# EAGLE design dip8_a3 (EAGLE 5.11)
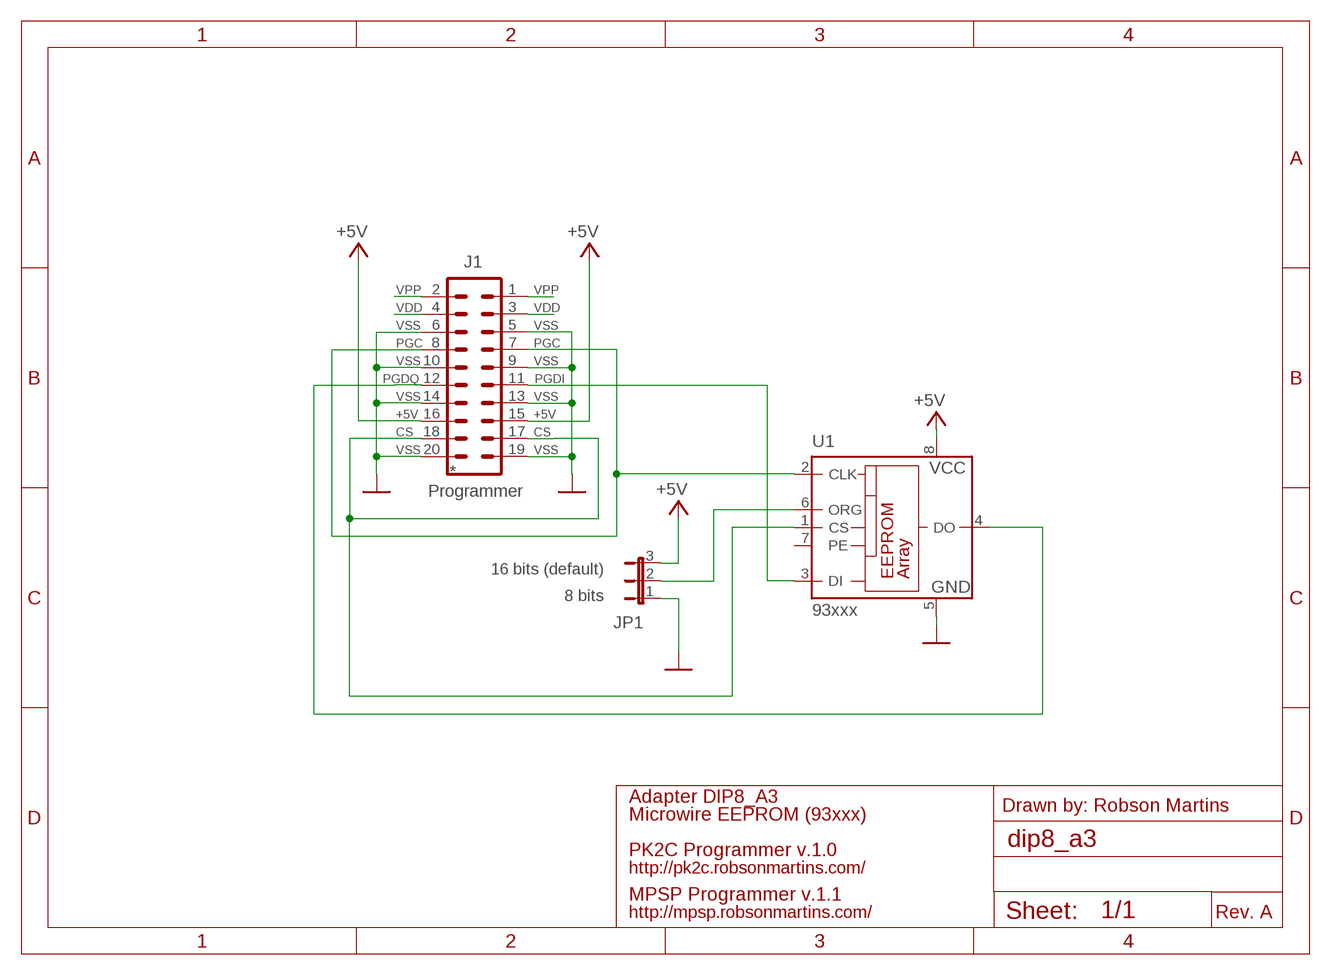
[diagram p0: schematic, sheet 1]

## Parts
J1  Programmer  MA10-2  [MA10-2]
JP1  JP2E  [JP2]
U1  93xxx  93C76CP  [DIL8]

## Nets
+5V: J1.15 J1.16 JP1.3 U1.8(VCC)
CS: J1.17 J1.18 U1.1(CS)
GND: J1.5 J1.6 J1.9 J1.10 J1.13 J1.14 J1.19 J1.20 JP1.1 U1.5(GND)
ORG_CHIP: JP1.2 U1.6(ORG)
PGC: J1.7 J1.8 U1.2(CLK)
PGDI: J1.11 U1.3(DI)
PGDQ: J1.12 U1.4(DO)
VDD: J1.3 J1.4
VPP: J1.1 J1.2
Unconnected: U1.7(PE)

## Notes on the sheet
- VPP | VPP
- VDD | VDD
- VSS | VSS
- PGC | PGC
- VSS | VSS
- PGDQ | PGDI
- VSS | VSS
- +5V | +5V
- CS | CS
- VSS | VSS
- *
- 16 bits (default)
- 8 bits
- Adapter DIP8_A3
- Drawn by: Robson Martins
- Microwire EEPROM (93xxx)
- PK2C Programmer v.1.0
- http://pk2c.robsonmartins.com/
- MPSP Programmer v.1.1
- http://mpsp.robsonmartins.com/ | Rev. A

## Library data of the parts
J1 = con-lstb:MA10-2: PIN HEADER; OC_FARNELL: unknown; OC_NEWARK: unknown
JP1 = jumper:JP2E: JUMPER
U1 = microchip:93*76C: 8K Microwire Compatible Serial EEPROM Source: http://ww1.microchip.com/downloads/en/DeviceDoc/21796H.pdf; MF: MICROCHIP; MPN: 93C76C-I/P; OC_FARNELL: unknown; OC_NEWARK: 61H6696

## Board
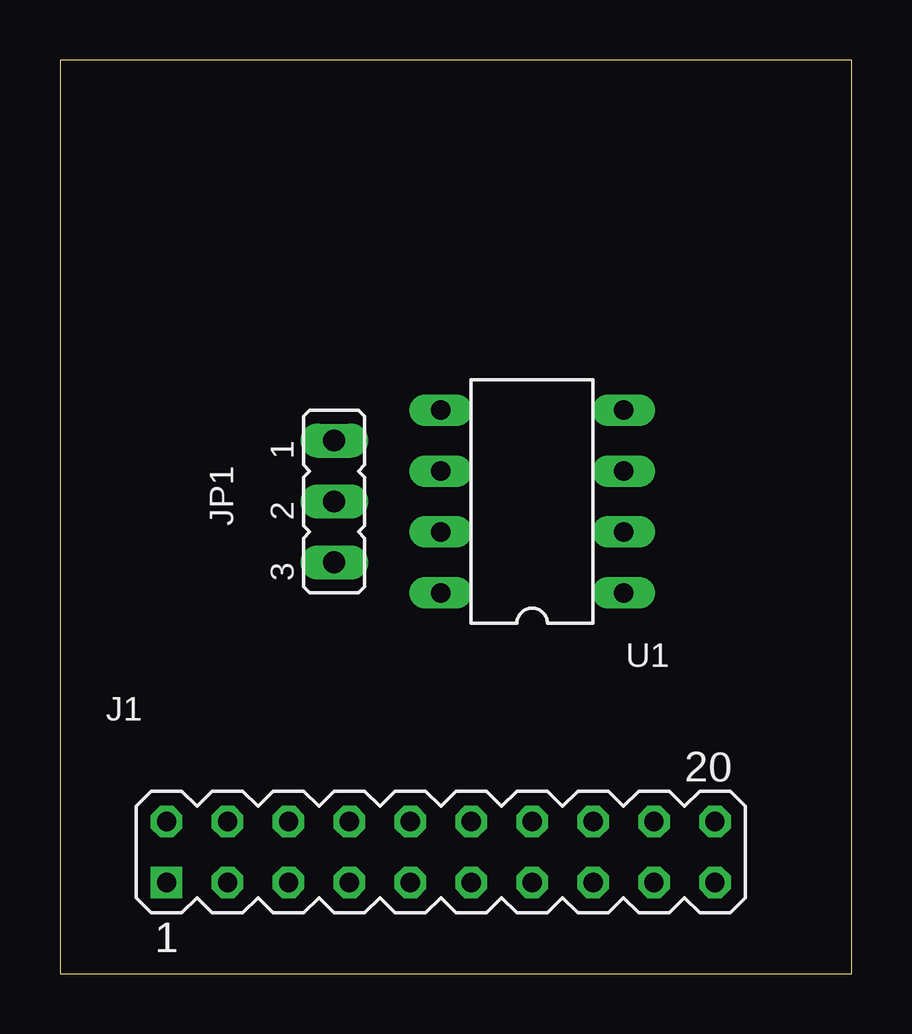
[diagram p1: board, top side]
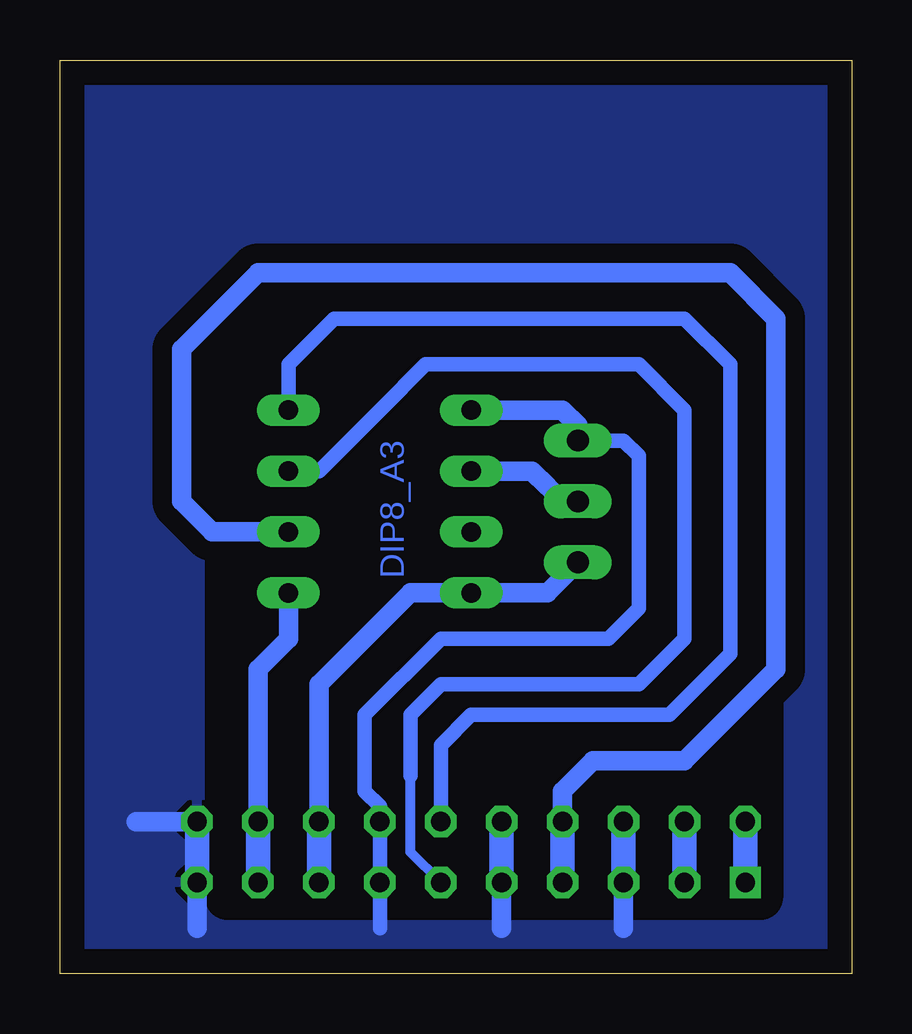
[diagram p2: board, bottom side, seen from below]

Size 33.02 x 38.08 mm. Coordinates in mm from the lower left corner, seen from the top.
Outline: 33.02,0 33.02,38.08 0,38.08 0,0 33.02,0
Copper layers (1*16): Top 0.035mm / dielectric 1.5mm / Bottom 0.035mm
Design rules "default": minimum track width 10mil, minimum drill 24mil, track to track 8mil, track to pad 8mil, pad to pad 8mil, via to via 8mil, smd to smd 8mil, copper to edge 40mil, drill to drill 8mil, minimum pad ring 10mil, minimum via ring 8mil, stop-mask expansion 4mil, vias tented up to drill 0mil, thermal gap 10mil
bRestrict: area 3.8,3.2 to 26,9.5; area 3.8,9.5 to 26,26.7

### Footprints (pad centres in the part's own frame; a part is rotated, then mirrored left to right if it is on the bottom)
MA10-2 = drill 0.8 pad 1.27 square: 1 -11.43,-1.27 | drill 0.8 pad 1.27 octagon: 2 -11.43,1.27; 3 -8.89,-1.27; 4 -8.89,1.27; 5 -6.35,-1.27; 6 -6.35,1.27; 7 -3.81,-1.27; 8 -3.81,1.27; 9 -1.27,-1.27; 10 -1.27,1.27; 11 1.27,-1.27; 12 1.27,1.27; 13 3.81,-1.27; 14 3.81,1.27; 15 6.35,-1.27; 16 6.35,1.27; 17 8.89,-1.27; 18 8.89,1.27; 19 11.43,-1.27; 20 11.43,1.27
JP2 = drill 0.914 long: 1 -2.54,0; 2 0,0; 3 2.54,0
DIL8 = drill 0.813 long: 1 -3.81,-3.81; 2 -1.27,-3.81; 3 1.27,-3.81; 4 3.81,-3.81; 5 3.81,3.81; 6 1.27,3.81; 7 -1.27,3.81; 8 -3.81,3.81

### Placement (x,y rotation side)
J1  15.88,5.08 0 top
JP1  11.43,19.68 270 top
U1  19.69,19.68 90 top

### Tracks (layer width: path | path; a pad name or v marks a point on that pad's centre or on a via)
+5V
  Bottom 0.813: J1.16 22.23,8.89 22.23,12.06 18.42,15.88 U1.8 12.7,15.88 JP1.3
  Bottom 1.016: J1.15 J1.16
CS
  Bottom 0.813: J1.18 24.77,12.7 23.5,13.97 U1.1
  Bottom 1.016: J1.17 J1.18
GND
  Bottom 0.61: JP1.1 9.53,22.23 8.89,21.59 8.89,15.24 10.16,13.97 17.15,13.97 20.32,10.79 20.32,8.89 20.32,7.62 19.69,6.99 J1.14 J1.13 19.69,1.91
  Bottom 0.813: 9.53,1.91 J1.6 | 14.61,1.91 J1.9 | 27.31,1.91 J1.19 | J1.20 29.85,6.35 | JP1.1 11.43,22.86 12.07,23.5 U1.5
  Bottom 1.016: J1.6 J1.5 | J1.9 J1.10 | J1.19 J1.20
  pour Bottom (isolate 0.813): 33.02,0 0,0 0,38.1 33.02,38.1
ORG_CHIP
  Bottom 0.813: JP1.2 12.07,19.68 12.7,20.32 13.34,20.95 U1.6
PGC
  Bottom 0.813: J1.8 12.07,7.62 10.8,8.89 6.99,8.89 3.18,12.7 3.18,27.3 5.08,29.21 24.77,29.21 27.94,26.04 27.94,19.68 26.67,18.41 U1.2
  Bottom 1.016: J1.7 J1.8
PGDI
  Bottom 0.406: 18.42,8.89 18.42,8.26 18.42,5.08 J1.11
  Bottom 0.61: 18.42,8.26 18.42,10.16 18.42,10.79 17.15,12.06 8.89,12.06 6.99,13.97 6.99,23.5 8.89,25.4 17.78,25.4 19.69,23.5 22.23,20.95 U1.3
PGDQ
  Bottom 0.61: J1.12 17.15,9.53 15.88,10.79 7.62,10.79 5.08,13.34 5.08,25.4 6.99,27.3 21.59,27.3 23.5,25.4 U1.4
VDD
  Bottom 1.016: J1.3 J1.4
VPP
  Bottom 1.016: J1.1 J1.2

### Text on the board
Bottom: DIP8_A3
tDocu: Microwire EEPROM | 93xxx | DIP8_A3 | Adapter | rev. A | 8 bits | 16 bits | VSS | VPP | VDD | VSS | PGC | VSS | PGDI/Q | VSS | +5V | CS